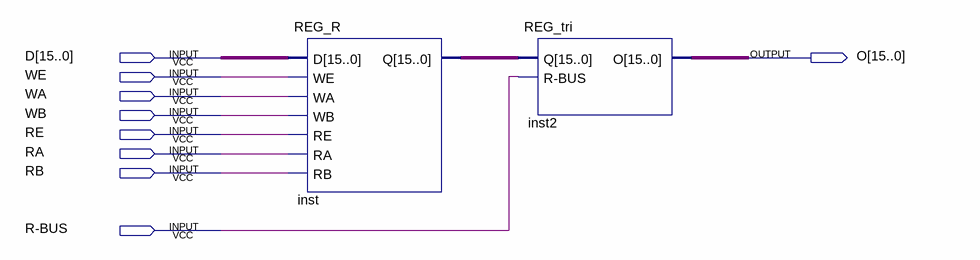
[diagram p0: schematic sheet]
// Quartus schematic REG.bdf as structural Verilog: 2 symbols, 9 pins
module REG (
  input  [15:0] D,
  input  WE,
  input  WA,
  input  WB,
  input  RE,
  input  RA,
  input  RB,
  input  \R-BUS ,
  output [15:0] O
);

  wire [15:0] inst_q;

  REG_R inst (.D(D), .WE(WE), .WA(WA), .WB(WB), .RE(RE), .RA(RA), .RB(RB), .Q(inst_q));
  REG_tri inst2 (.Q(inst_q), .\R-BUS (\R-BUS ), .O(O));
endmodule
